# EAGLE design RMP - HV Iso Current Monitor  0.0.1 (EAGLE 9.6.2)

## Sheet 1 of 4
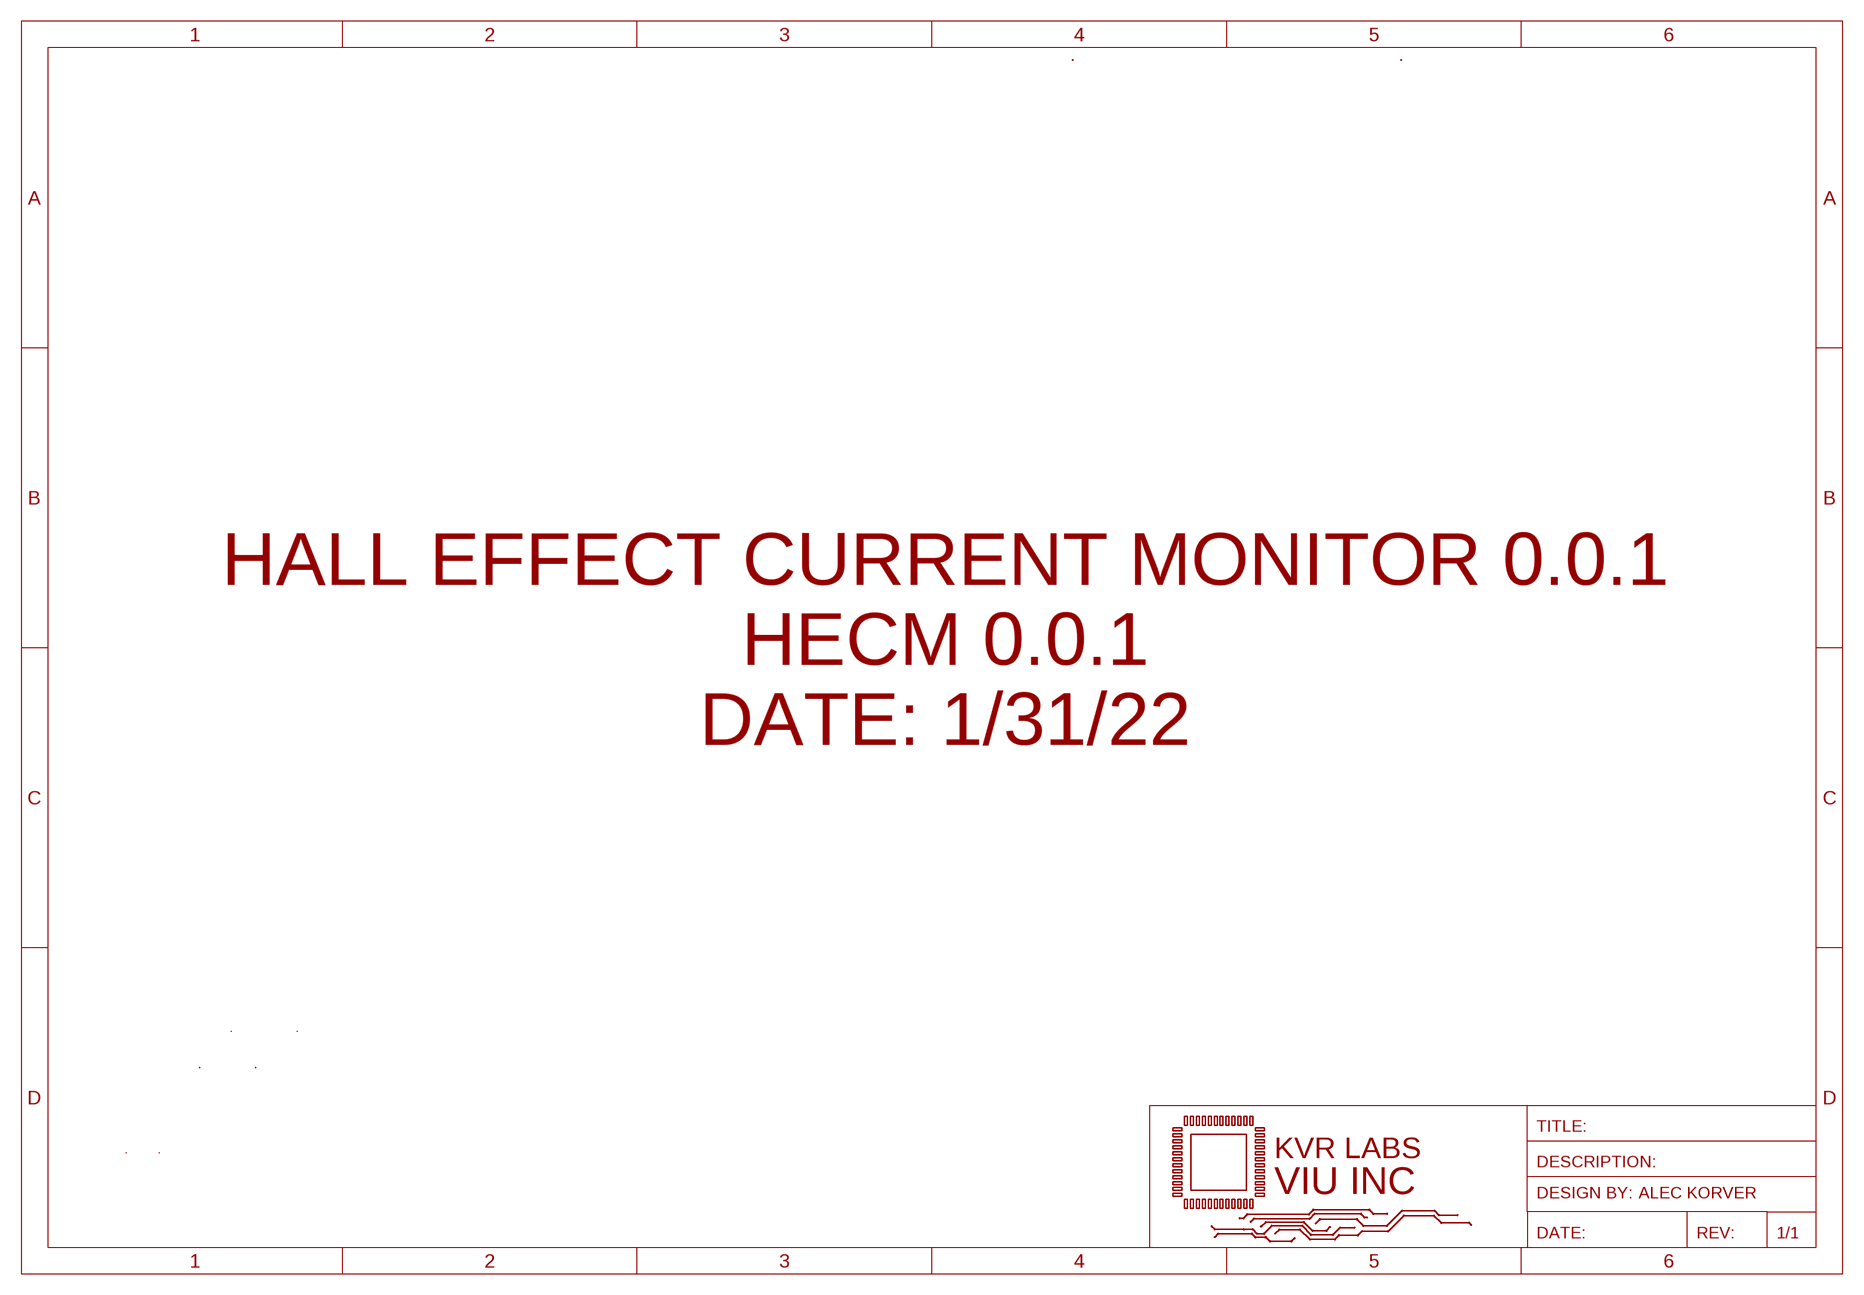
[diagram p0: schematic, sheet 1]

### Notes on the sheet
- HALL EFFECT CURRENT MONITOR 0.0.1
  HECM 0.0.1
  DATE: 1/31/22

## Sheet 2 of 4: HV-Current Monitor
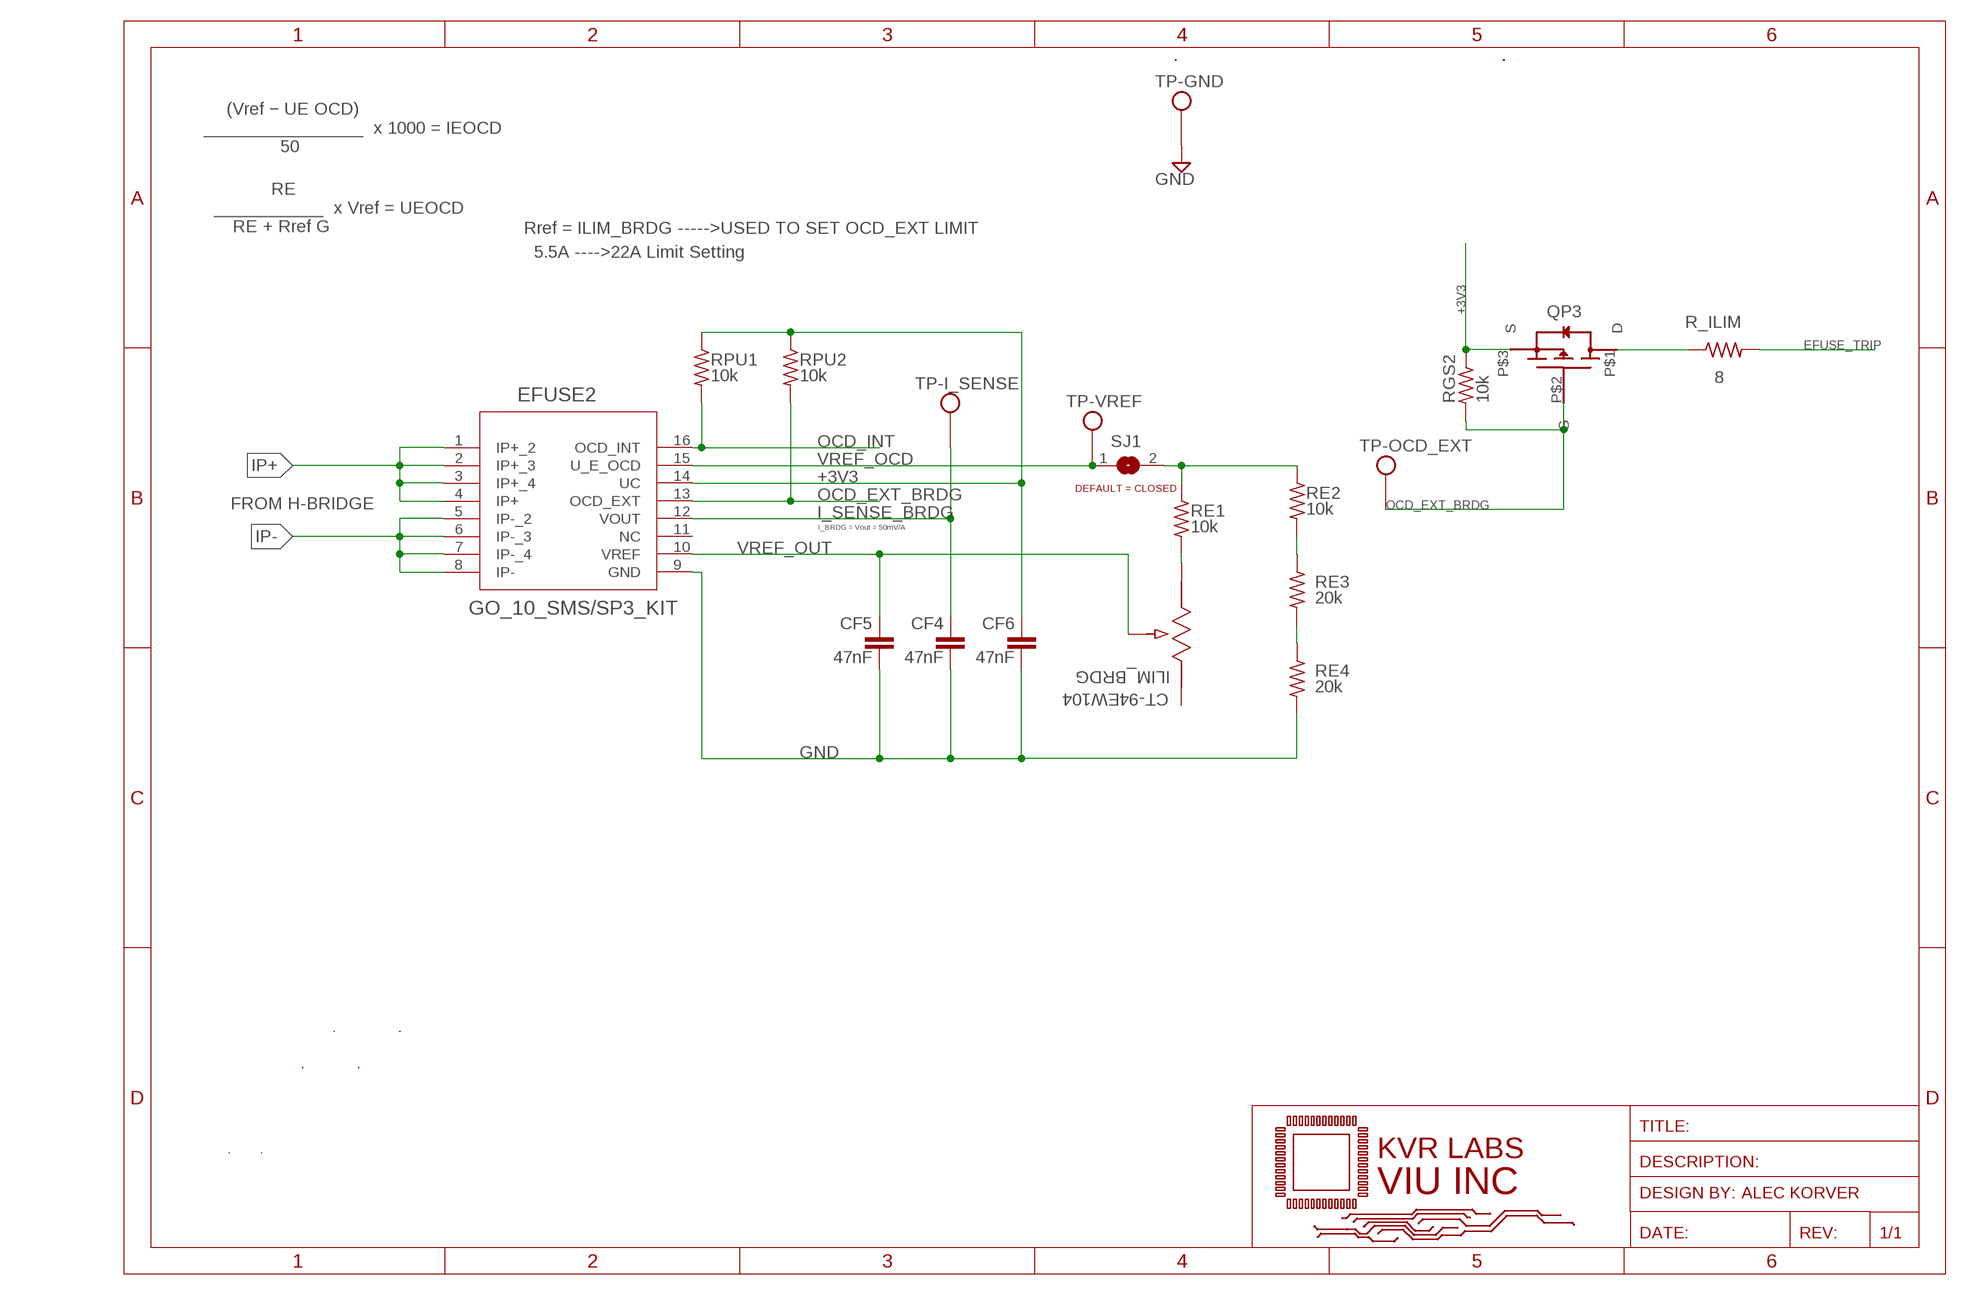
[diagram p1: schematic, sheet 2]

### Parts
CF4  47nF  C-EUC0603  [C0603]
CF5  47nF  C-EUC0603  [C0603]
CF6  47nF  C-EUC0603  [C0603]
EFUSE2  GO_10_SMS/SP3_KIT  [SOIC_GO_10_SM_LEM]
ILIM_BRDG  CT-94EW104  [POT_CT-94EW_NDC]
QP3  PFET-(SOT-23-3)(TO-236-3)(SC-59)  [SOT23,SC-59,TO-236-3]
R_ILIM  8  R-US_R1206  [R1206]
RE1  10k  R-US_R0603  [R0603]
RE2  10k  R-US_R0603  [R0603]
RE3  20k  R-US_R0603  [R0603]
RE4  20k  R-US_R0603  [R0603]
RGS2  10k  R-US_R0603  [R0603]
RPU1  10k  R-US_R0603  [R0603]
RPU2  10k  R-US_R0603  [R0603]
SJ1  SJ  [SJ]
TP-GND  THM_TESTPOINT_5000_SERIES  [THM-TESTPOINT]
TP-I_SENSE  THM_TESTPOINT_5000_SERIES  [THM-TESTPOINT]
TP-OCD_EXT  THM_TESTPOINT_5000_SERIES  [THM-TESTPOINT]
TP-VREF  THM_TESTPOINT_5000_SERIES  [THM-TESTPOINT]

### Nets
+3V3: CF6.1 EFUSE2.14(UC) QP3.P$3(S) RGS2.1 RPU1.1 RPU2.1 ; also sheet 3
EFUSE_TRIP: R_ILIM.2 ; also sheet 4
GND: CF4.2 CF5.2 CF6.2 EFUSE2.9(GND) RE4.2 TP-GND.P1 ; also sheet 3,4
I_SENSE_BRDG: CF4.1 EFUSE2.12(VOUT) TP-I_SENSE.P1 ; also sheet 4
IP+: EFUSE2.1(IP+_2) EFUSE2.2(IP+_3) EFUSE2.3(IP+_4) EFUSE2.4(IP+) ; also sheet 4
IP-: EFUSE2.5(IP-_2) EFUSE2.6(IP-_3) EFUSE2.7(IP-_4) EFUSE2.8(IP-) ; also sheet 4
N$3: RE1.1 RE2.1 SJ1.2
N$14: RE2.2 RE3.1
N$15: RE3.2 RE4.1
N$16: QP3.P$1(D) R_ILIM.1
N$37: ILIM_BRDG.3 RE1.2
OCD_EXT_BRDG: EFUSE2.13(OCD_EXT) QP3.P$2(G) RGS2.2 RPU2.2 TP-OCD_EXT.P1
OCD_INT: EFUSE2.16(OCD_INT) RPU1.2
VREF_OCD: EFUSE2.15(U_E_OCD) SJ1.1 TP-VREF.P1 ; also sheet 4
VREF_OUT: CF5.1 EFUSE2.10(VREF) ILIM_BRDG.2
Unconnected: EFUSE2.11(NC) ILIM_BRDG.1

### Notes on the sheet
- (Vref − UE OCD)
                          ________________  x 1000 = IEOCD
  50
- RE
                        ___________  x Vref = UEOCD
  RE + Rref G
- Rref = ILIM_BRDG ----->USED TO SET OCD_EXT LIMIT
- 5.5A ---->22A Limit Setting
- DEFAULT = CLOSED
- FROM H-BRIDGE
- I_BRDG = Vout = 50mV/A

## Sheet 3 of 4: POWER SUPPLY - DC/DC
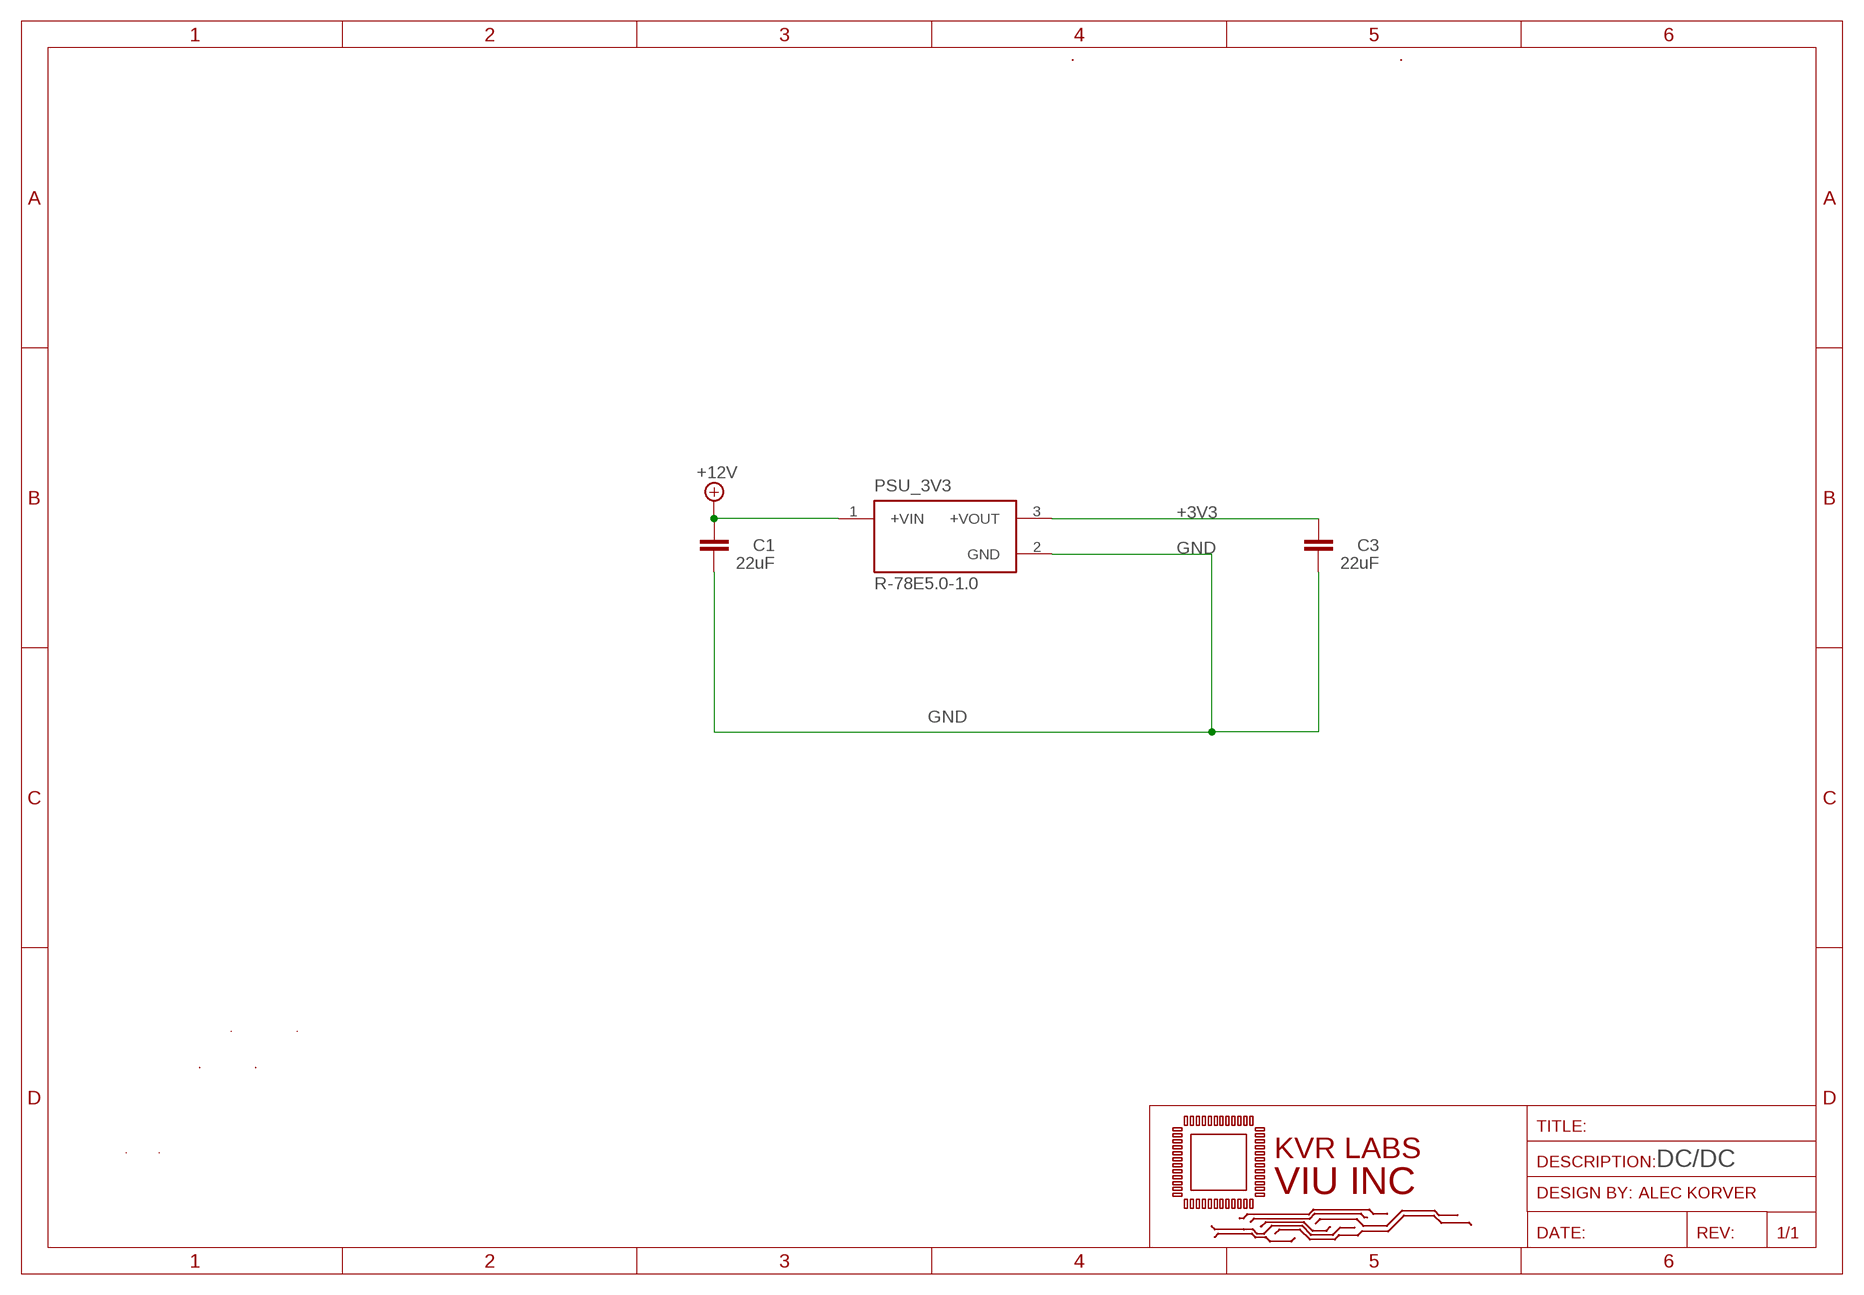
[diagram p2: schematic, sheet 3]

### Parts
C1  22uF  C-EUC1206  [C1206]
C3  22uF  C-EUC1206  [C1206]
PSU_3V3  R-78E5.0-1.0  [CONV_R-78E5.0-1.0]

### Nets
+3V3: C3.2 PSU_3V3.3(+VOUT) ; also sheet 2
+12V: C1.2 PSU_3V3.1(+VIN) ; also sheet 4
GND: C1.1 C3.1 PSU_3V3.2(GND) ; also sheet 2,4

### Notes on the sheet
- DC/DC

## Sheet 4 of 4: CONNECTORS
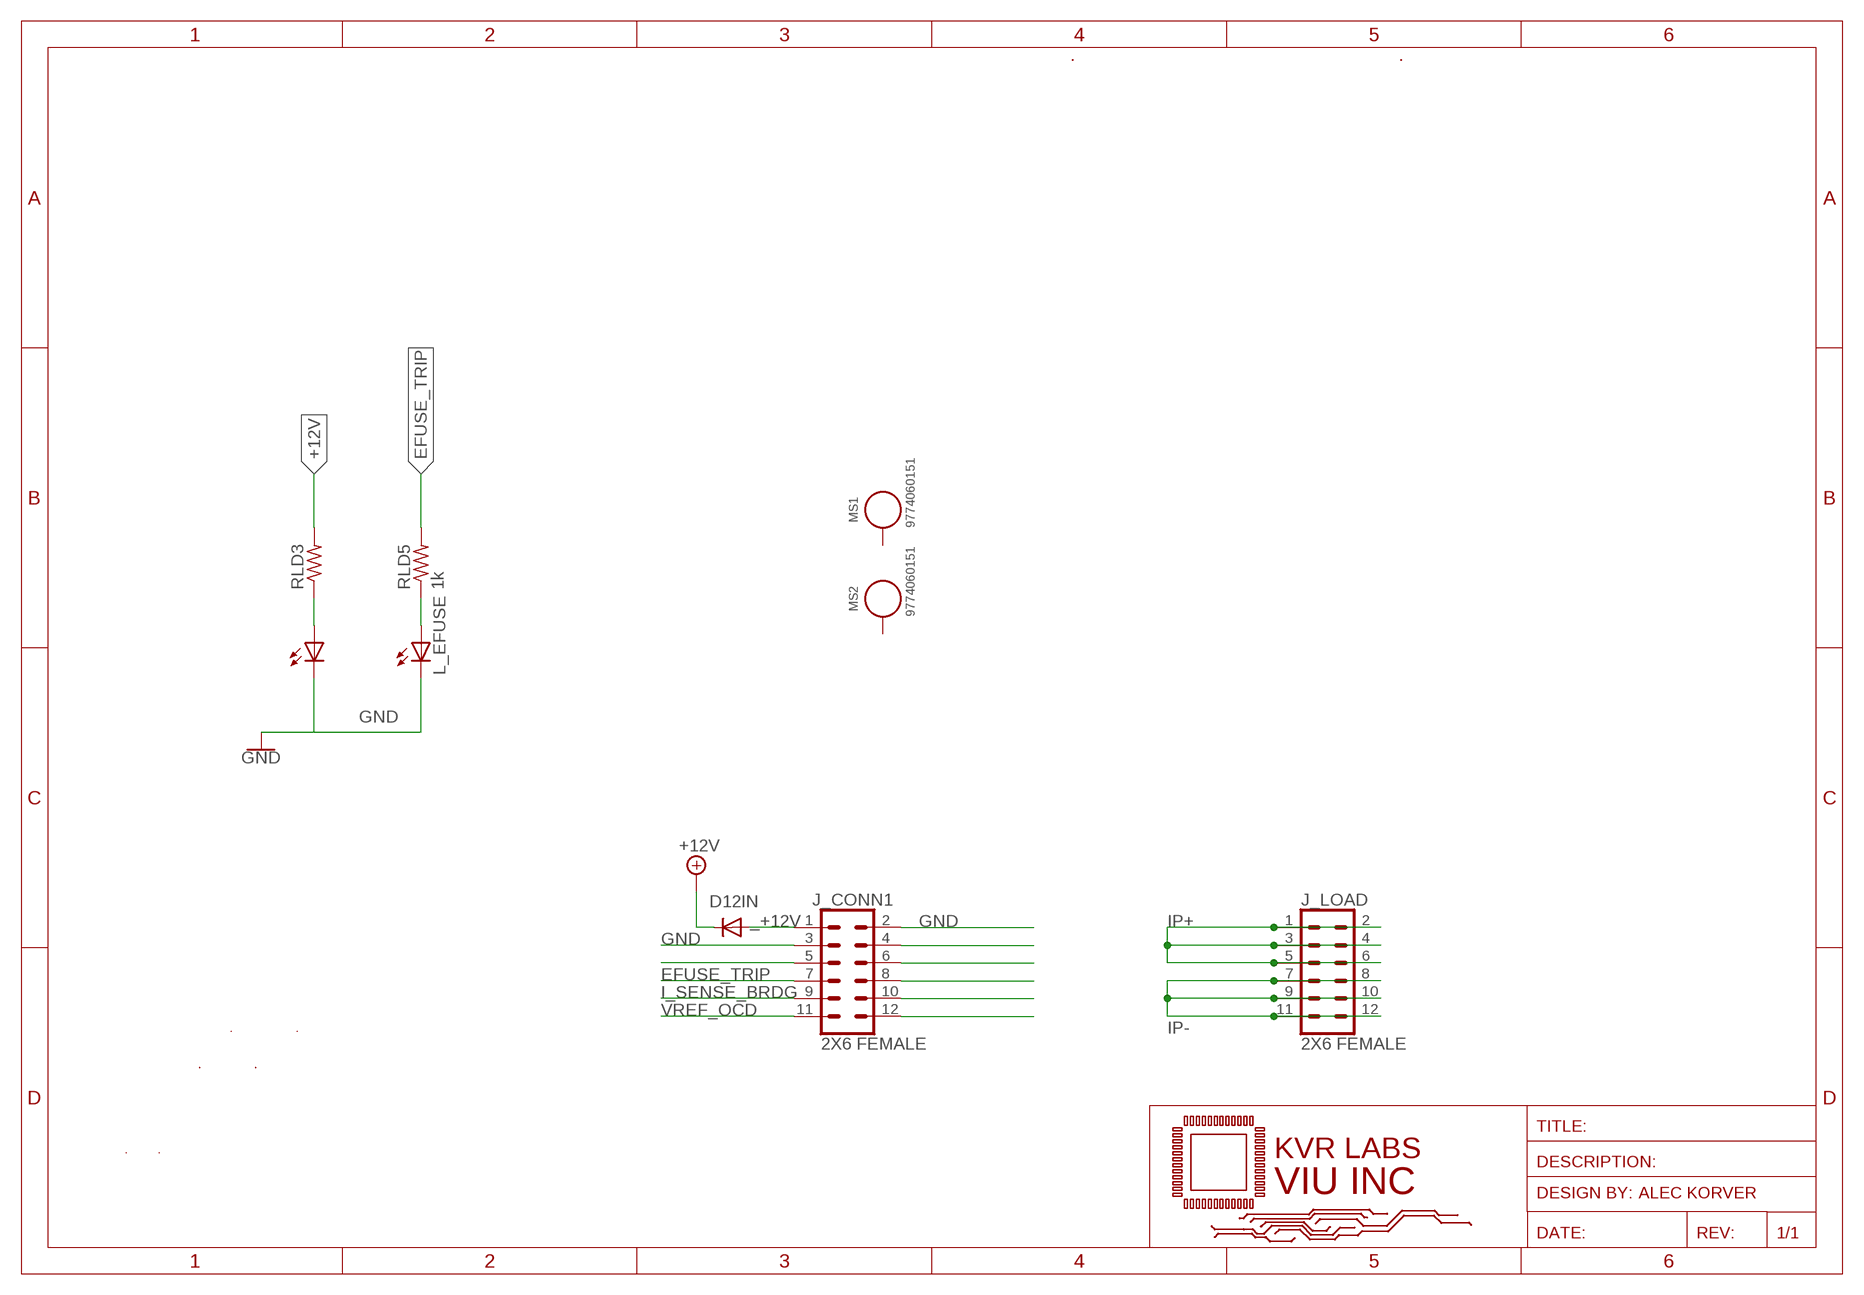
[diagram p3: schematic, sheet 4]

### Parts
D12IN  DIODESMA  [SMADIODE]
J_CONN1  2X6 FEMALE  CONN_06X2PTH_FEMALE  [2X6]
J_LOAD  2X6 FEMALE  CONN_06X2PTH_FEMALE  [2X6]
L_12V  LEDCHIPLED_1206  [CHIPLED_1206]
L_EFUSE  LEDCHIPLED_1206  [CHIPLED_1206]
MS1  9774060151  WA-SMSI_9774XXX151_9774060151  [WA-SMSI_9774060151]
MS2  9774060151  WA-SMSI_9774XXX151_9774060151  [WA-SMSI_9774060151]
RLD3  1k  R-US_R1206  [R1206]
RLD5  1k  R-US_R1206  [R1206]

### Nets
+12V: D12IN.C RLD3.2 ; also sheet 3
_+12V: D12IN.A J_CONN1.1
EFUSE_TRIP: J_CONN1.7 RLD5.2 ; also sheet 2
GND: J_CONN1.2 J_CONN1.3 L_12V.C ; also sheet 2,3
GND2: L_EFUSE.C
I_SENSE_BRDG: J_CONN1.9 ; also sheet 2
IP+: J_LOAD.1 J_LOAD.2 J_LOAD.3 J_LOAD.4 J_LOAD.5 J_LOAD.6 ; also sheet 2
IP-: J_LOAD.7 J_LOAD.8 J_LOAD.9 J_LOAD.10 J_LOAD.11 J_LOAD.12 ; also sheet 2
N$1: J_CONN1.10
N$2: J_CONN1.12
N$4: J_CONN1.4
N$5: J_CONN1.6
N$6: J_CONN1.8
N$9: J_CONN1.5
N$20: L_12V.A RLD3.1
N$23: L_EFUSE.A RLD5.1
VREF_OCD: J_CONN1.11 ; also sheet 2
Unconnected: MS1.1 MS2.1

## Library data of the parts
C1 C3 = rcl:C-EU: CAPACITOR, European symbol; LCSC_PART: C77091; SPICEPREFIX: C
CF4-CF6 = rcl:C-EU: CAPACITOR, European symbol; LCSC_PART: C76712; SPICEPREFIX: C
D12IN = adafruit:DIODE: Diode SMADIODE - SMA Surface Mount Package 20V 1A Schottky Diode Digikey: 641-1014-6-ND DO-1N4148 - Through Hole Small Current Diode SOD-123 20V 1 A (.5mV Vf) Schottky Diode - Digikey: MBRX120TPMSCT-ND SOD-323 10V 570mA (.38mV Vf, 3ns) Schottky Diode - Digikey: ZLLS410CT-ND SOD-523 30V 30mA Schottky Diode (RB751S-40TE61) - Digikey: RB751S-40TE61CT-ND SOT23-R/W - SOT23 Package (R = Solder Paste/Reflow Ovens, W = Hand-Soldering) BAT54Film 40V 300mA - Digikey: 497-7162-1-ND; I_AVG: 1A; LCSC_PART: C110531; VF: 1.3V; VR: 400V
EFUSE2 = KVRLABS-Amplifiers:GO_10_SMS/SP3_KIT; COPYRIGHT: Copyright (C) 2021 Ultra Librarian. All rights reserved.; LCSC_PART: DNP; MANUFACTURER_PART_NUMBER: GO 10 SMS/SP3 KIT; MFR_NAME: LEM
ILIM_BRDG = KVRLABS-Potentiometers:CT-94EW104; COPYRIGHT: Copyright (C) 2021 Ultra Librarian. All rights reserved.; DIGI-KEY_PART_NUMBER_1: CT94EW104-ND; LCSC_PART: DNP; MANUFACTURER_PART_NUMBER: CT-94EW104; MFR_NAME: Nidec Copal Electronics
J_CONN1 J_LOAD = SparkFun-Connectors:CONN_06X2: Multi connection point. Often used as Generic Header-pin footprint for 0.1 inch spaced/style header connections On any of the 0.1 inch spaced packages, you can populate with these: Break Away Headers - Straight <https://www.sparkfun.com/products/116> (PRT-00116) Break Away Male Headers - Right Angle <https://www.sparkfun.com/products/553> (PRT-00553) Female Headers <https://www.sparkfun.com/products/115> (PRT-00115) Break Away Headers - Machine Pin <https://www.sparkfun.com/products/117> (PRT-00117) Break Away Female Headers - Swiss Machine Pin <https://www.sparkfun.com/products/743> (PRT-00743); LCSC_PART: DNP; MODEL: TSW-106-05-G-D; PROD_ID: CONN-12423
L_12V L_EFUSE = adafruit:LED: LED OSRAM: - CHIPLED LG R971, LG N971, LY N971, LG Q971, LY Q971, LO R971, LY R971 LH N974, LH R974 LS Q976, LO Q976, LY Q976 LO Q996 - Hyper CHIPLED LW Q18S LB Q993, LB Q99A, LB R99A - SideLED LS A670, LO A670, LY A670, LG A670, LP A670 LB A673, LV A673, LT A673, LW A673 LH A674 LY A675 LS A676, LA A676, LO A676, LY A676, LW A676 LS A679, LY A679, LG A679 - Hyper Micro SIDELED® LS Y876, LA Y876, LO Y876, LY Y876 LT Y87S - SmartLED LW L88C, LW L88S LB L89C, LB L89S, LG L890 LS L89K, LO L89K, LY L89K LS L896, LA L896, LO L896, LY L896 - TOPLED LS T670, LO T670, LY T670, LG T670, LP T670 LSG T670, LSP T670, LSY T670, LOP T670, LYG T670 LG T671, LOG T671, LSG T671 LB T673, LV T673, LT T673, LW T673 LH T674 LS T676, LA T676, LO T676, LY T676, LB T676, LH T676, LSB T676, LW T676 LB T67C, LV T67C, LT T67C, LS T67K, LO T67K, LY T67K, LW E67C LS E67B, LA E67B, LO E67B, LY E67B, LB E67C, LV E67C, LT E67C LW T67C LS T679, LY T679, LG T679 LS T770, LO T770, LY T770, LG T770, LP T770 LB T773, LV T773, LT T773, LW T773 LH T774 LS E675, LA E675, LY E675, LS T675 LS T776, LA T776, LO T776, LY T776, LB T776 LHGB T686 LT T68C, LB T68C - Hyper Mini TOPLED® LB M676 - Mini TOPLED Santana® LG M470 LS M47K, LO M47K, LY M47K Source: http://www.osram.convergy.de/; LCSC_PART: C434439
MS1 MS2 = Eagle_WA-SMSI (rev20d) (1):WA-SMSI_9774XXX151: WA-SMSI SMT Steel Spacer, M2.5 Thread Internal PROPERTIES Material Steel Surface Tin GENERAL INFORMATION Operating Temperature -55 up to +150 °C PACKAGING PROPERTIES Packaging Bag;​ Tape and Reel;​ Bulk Packaging Unit 450 <https://katalog.we-online.de/media/images/v2/o92910v209%20Family_WA-SMSI_M2-M2.5.jpg> Details see: https://katalog.we-online.de/en/em/SMSI_SMT_STEEL_SPACER_M2_5_THREAD_INTERNAL Updated by Ella Wu 2020-05-18 2020(C) Wurth Elektronik; DATASHEET-URL: https://www.we-online.de/katalog/datasheet/9774060151.pdf; INNER-DIAMETER: 3.5mm; INNER-THREAD-LENGTH: -; OUTER-DIAMETER: 5.1mm; PART-NUMBER: 9774060151; PIN-LENGTH: 6mm; THREAD: M2.5
PSU_3V3 = R-78E5.0-1.0:R-78E5.0-1.0: 1.0 Amp SIP3 Single Output; DESCRIPTION: 1A DC/DC-Converter 'INNOLINE' SIP3 reg; LCSC_PART: DNP; MF: Recom Power; MP: R-78E5.0-1.0; PACKAGE: SIP-3 Recom Power; PURCHASE-URL: https://pricing.snapeda.com/search/part/R-78E5.0-1.0/?ref=eda
QP3 = KVRLABS-Nfet:Pfet:PFET-(SOT-23-3)(TO-236-3)(SC-59); LCSC_PART: C489594; MODEL: MEM2307M3G
R_ILIM = rcl:R-US_: RESISTOR, American symbol; LCSC_PART: C114478; SPICEPREFIX: R
RE1 RE2 RGS2 RPU1 RPU2 = rcl:R-US_: RESISTOR, American symbol; LCSC_PART: C116677; SPICEPREFIX: R
RE3 RE4 = rcl:R-US_: RESISTOR, American symbol; LCSC_PART: C118368; SPICEPREFIX: R
RLD3 RLD5 = rcl:R-US_: RESISTOR, American symbol; LCSC_PART: C115421; SPICEPREFIX: R
SJ1 = jumper:SJ: SMD solder JUMPER
TP-GND TP-I_SENSE TP-OCD_EXT TP-VREF = PSFBC:THM_TESTPOINT_5000_SERIES; LCSC_PART: DNP

## Net classes
0 default: width 0.089 mm, drill 0.2 mm, clearance 0.089 mm

## Board
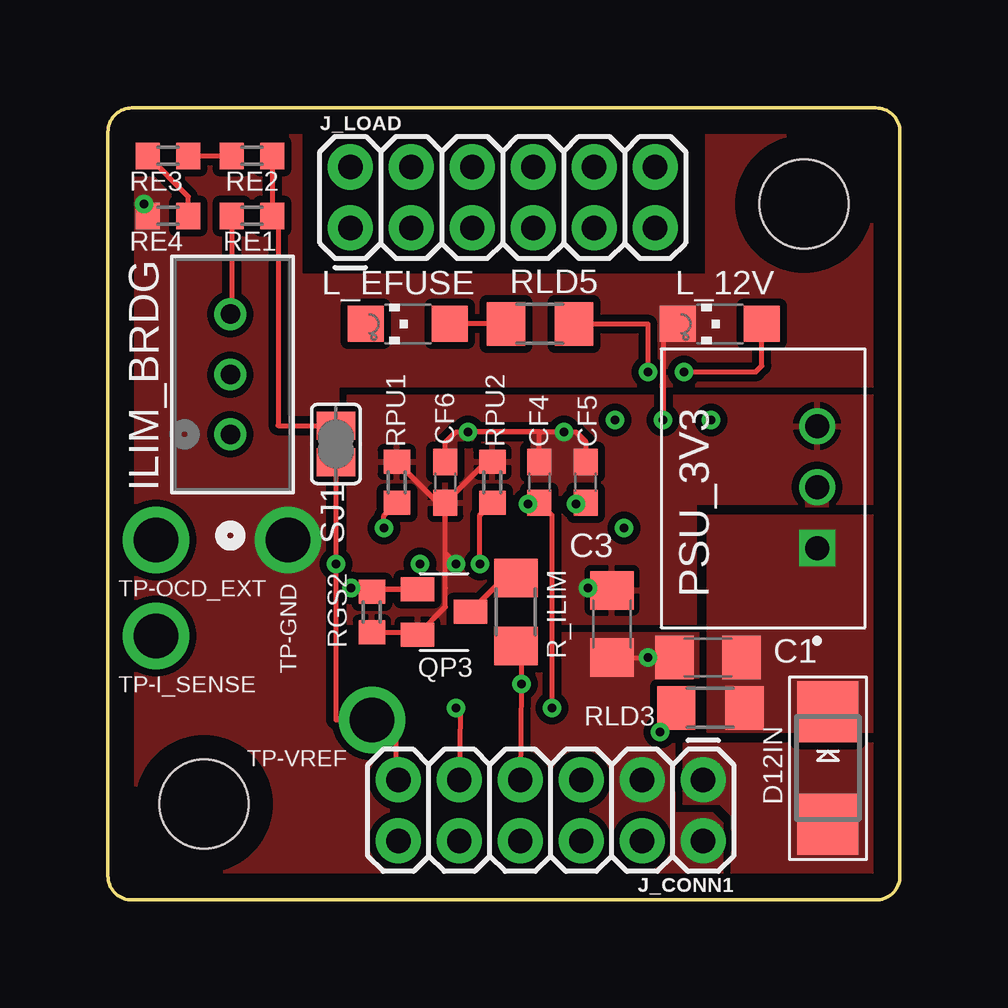
[diagram p4: board, top side]
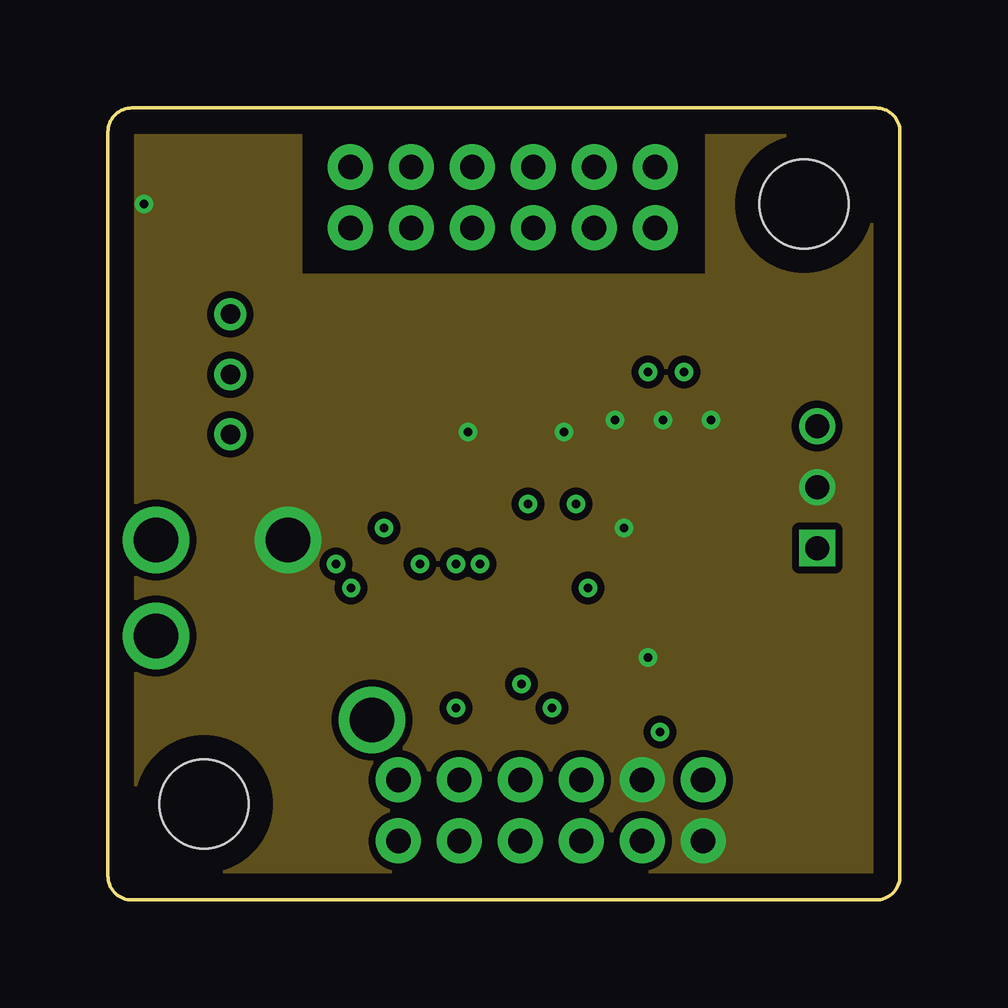
[diagram p5: board, inner layer Route2]
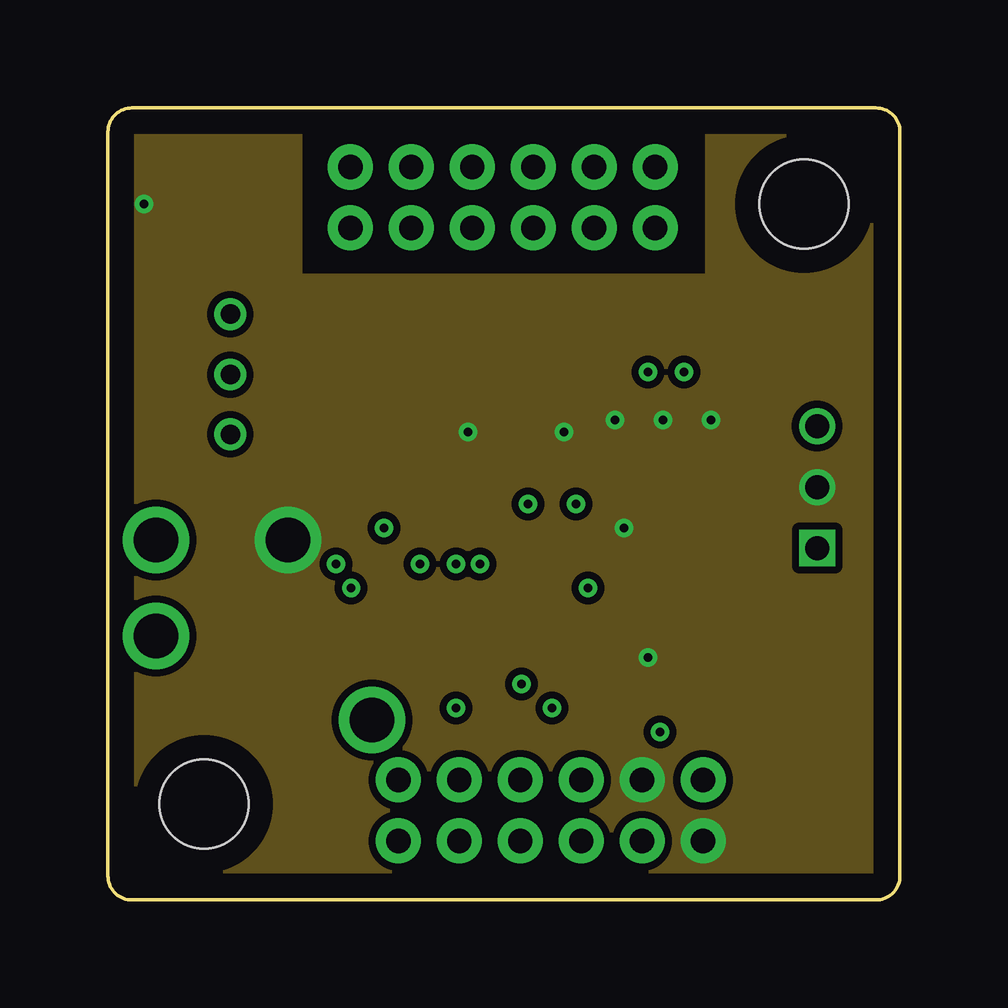
[diagram p6: board, inner layer Route15]
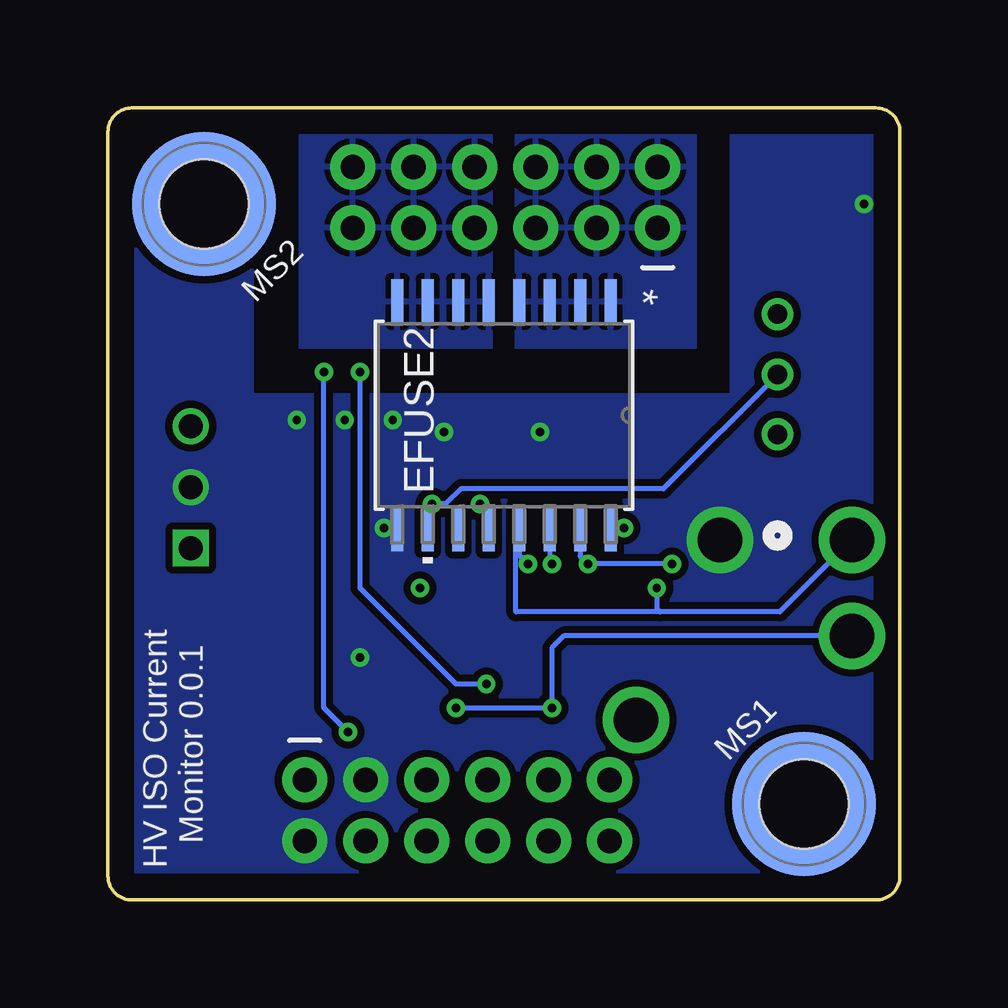
[diagram p7: board, bottom side, seen from below]

Size 33 x 33 mm. Coordinates in mm from the lower left corner, seen from the top.
Outline: 0,1 0,32 arc-90 1,33 32,33 arc-90 33,32 33,1 arc-90 32,0 1,0 arc-90 0,1
Copper layers (1*2*15*16): Top 0.035mm / dielectric 1.5mm / Route2 0.035mm / dielectric 0.15mm / Route15 0.035mm / dielectric 0.2mm / Bottom 0.035mm
Design rules "default *": minimum track width 6mil, minimum drill 0.35mm, track to track 6mil, track to pad 6mil, pad to pad 6mil, via to via 6mil, smd to smd 6mil, copper to edge 40mil, drill to drill 6mil, minimum pad ring 10mil, minimum via ring 8mil, stop-mask expansion 4mil, vias tented up to drill 0mil, thermal gap 10mil
vRestrict: 1 lines

### Footprints (pad centres in the part's own frame; a part is rotated, then mirrored left to right if it is on the bottom)
C1206 = smd 1.6 x 1.8: 1 -1.4,0; 2 1.4,0
C0603 = smd 1.1 x 1: 1 -0.85,0; 2 0.85,0
SMADIODE = smd 2.54 x 2.54: A 2.349,0; C -2.349,0
SOIC_GO_10_SM_LEM = smd 1.874 x 0.507: 1 -4.734,4.445; 2 -4.734,3.175; 3 -4.734,1.905; 4 -4.734,0.635; 5 -4.734,-0.635; 6 -4.734,-1.905; 7 -4.734,-3.175; 8 -4.734,-4.445; 9 4.734,-4.445; 10 4.734,-3.175; 11 4.734,-1.905; 12 4.734,-0.635; 13 4.734,0.635; 14 4.734,1.905; 15 4.734,3.175; 16 4.734,4.445
POT_CT-94EW_NDC = drill 0.813 pad 1.321: 1 0,0; 2 2.489,0; 3 5.004,0
2X6 = drill 1.016 pad 1.88: 1 0,0; 2 0,2.54; 3 2.54,0; 4 2.54,2.54; 5 5.08,0; 6 5.08,2.54; 7 7.62,0; 8 7.62,2.54; 9 10.16,0; 10 10.16,2.54; 11 12.7,0; 12 12.7,2.54
CHIPLED_1206 = smd 1.5 x 1.5: A 0,-1.75; C 0,1.75
WA-SMSI_9774060151 = smd 6 x 6: 1 0,0 | hole 3.7: 0,0
CONV_R-78E5.0-1.0 = drill 1 square: 1 -2.54,-2.25 | drill 1: 2 0,-2.25; 3 2.54,-2.25
SOT23,SC-59,TO-236-3 = smd 1 x 1.4: P$1 0,1.1; P$2 -0.95,-1.1; P$3 0.95,-1.1
R1206 = smd 1.6 x 1.803: 1 -1.422,0; 2 1.422,0
R0603 = smd 1 x 1.1: 1 -0.85,0; 2 0.85,0
SJ = smd 1.168 x 1.6: 1 -0.762,0; 2 0.762,0
THM-TESTPOINT = drill 1.84: P1 0,0

### Placement (x,y rotation side)
C1  25,10.1 0 top
C3  21,11.5 90 top
CF4  17.98,17.4 90 top
CF5  19.9,17.4 90 top
CF6  14.06,17.4 90 top
D12IN  30,5.5 270 top
EFUSE2  16.5,20.2 270 bottom
ILIM_BRDG  5.1,19.4 90 top
J_CONN1  24.8,5 180 top
J_LOAD  10.1,28 0 top
L_12V  25.5,24 90 top
L_EFUSE  12.5,24 90 top
MS1  4,4 0 bottom
MS2  29,29 0 bottom
PSU_3V3  27.3,17.2 90 top
QP3  14,12 270 top
R_ILIM  17,12 270 top
RE1  6,28.5 180 top
RE2  6,31 180 top
RE3  2.5,31 180 top
RE4  2.5,28.5 180 top
RGS2  11,12 90 top
RLD3  25.1,8 0 top
RLD5  18,24 0 top
RPU1  12.04,17.4 270 top
RPU2  16.02,17.4 270 top
SJ1  9.5,19 90 top
TP-GND  7.5,15 0 top
TP-I_SENSE  2,11 0 top
TP-OCD_EXT  2,15 0 top
TP-VREF  11,7.5 180 top

### Tracks (layer width: path | path; a pad name or v marks a point on that pad's centre or on a via)
+3V3  (via drill 0.35)
  Top 0.2: QP3.P$3 14.06,12.21 14.06,13 14.06,14.44
  Top 0.203: RPU1.1 13.74,16.55 CF6.1 | CF6.1 15.76,18.25 RPU2.1 | v14.5,14 14.06,14.44 CF6.1 | RGS2.1 12.8,11.15 QP3.P$3 | C3.2 20.1,12.9 v20,13
  Bottom 0.203: EFUSE2.14 14.6,14.1 v14.5,14
  pour Top (isolate 0.3): 10,11.5 24.5,11.5 24.5,16.5 34,16.5 34,21 10,21
+12V
  pour Top (isolate 0.3, no thermals): 27.5,7 34,7 34,16 25,16 25,7
_+12V
  pour Top (isolate 0.3, no thermals): 24,4 25.5,4 26,3.5 26,-1 34.5,-1 34.5,6.5 24,6.5
EFUSE_TRIP  (via drill 0.35)
  Top 0.2: R_ILIM.2 17.23,10.35 v17.23,9 J_CONN1.7 | RLD5.2 22.5,24 v22.5,22
  Bottom 0.2: v22.5,22 22.5,13 18.5,9 v17.23,9
GND  (via drill 0.35)
  Top 0.2: L_12V.C 23.13,23.38 v23.13,20
  Top 0.203: CF6.2 14.06,19.06 14.5,19.5 v15,19.5 18,19.5 | 18,19.5 v19,19.5 19.5,19.5 19.9,19.1 CF5.2 | CF4.2 17.98,19.48 18,19.5 | RE4.2 1.65,28.85 v1.5,29 | C3.1 v22.5,10.1 C1.1
  Bottom 0.203: EFUSE2.9 21.47,15.47 v21.5,15.5
  other vias: 25.13,20 21.13,20
  pour Route2 (isolate 0.3, no thermals): -2,0 -2,35 8,35 8,26 25,26 25,35 35,35 35,-2 -2,-2
  pour Route15 (isolate 0.3, no thermals): -2,0 -2,35 8,35 8,26 25,26 25,35 35,35 35,-2 -2,-2
  pour Top (isolate 0.3, rank 5, no thermals): -2,0 -2,35 8,35 8,26 25,26 25,35 35,35 35,-2 -2,-2
  pour Bottom (isolate 0.3, no thermals): 7,35 7,21 27,21 27,35 35,35 35,-2 -2,-2 -2,35
I_SENSE_BRDG  (via drill 0.35)
  Top 0.2: CF4.1 18.5,16.03 v18.5,8 | v14.5,8 14.69,7.81 J_CONN1.9
  Top 0.203: v17.5,16.5 17.55,16.55 CF4.1
  Bottom 0.2: v18.5,8 v14.5,8 14.5,10.5 14,11 TP-I_SENSE.P1
  Bottom 0.203: EFUSE2.12 17.14,16.14 v17.5,16.5
IP+
  pour Bottom (isolate 0.3): 16,33.5 8.5,33.5 8.5,23 16,23
IP-
  pour Bottom (isolate 0.3): 17,23 17,33.5 25,33.5 25,23
N$3
  Top 0.203: RE2.1 RE1.1 7.09,28.26 7.09,19.76 SJ1.2
N$14
  Top 0.203: RE3.1 RE2.2
N$15
  Top 0.203: RE4.1 3.35,29.3 RE3.2
N$16
  Top 0.203: QP3.P$1 16.52,13.42 R_ILIM.1
N$20  (via drill 0.35)
  Top 0.2: RLD3.1 23,7.32 v23,7 | v24,22 27,22 27.25,22.25 L_12V.A
  Bottom 0.2: v23,7 24,8 v24,22
N$23
  Top 0.2: RLD5.1 L_EFUSE.A
N$37
  Top 0.203: RE1.2 5.15,24.45 ILIM_BRDG.3
OCD_EXT_BRDG  (via drill 0.35)
  Top 0.2: QP3.P$2 10.18,12.95 v10.13,13
  Top 0.203: v15.5,14 15.5,16.03 RPU2.2 | RGS2.2 11.1,12.95 QP3.P$2
  Bottom 0.2: TP-OCD_EXT.P1 5,12 10,12 | 15.87,15 16,14.87 16,12 10,12 | v10.13,13 10.13,12.13 10,12
  Bottom 0.203: EFUSE2.13 15.87,15 15.87,14.37 v15.5,14
OCD_INT  (via drill 0.35)
  Top 0.203: v11.5,15.5 11.5,16.01 RPU1.2
  Bottom 0.203: EFUSE2.16 11.53,15.47 v11.5,15.5
VREF_OCD  (via drill 0.35)
  Top 0.2: J_CONN1.11 12,5 12,7.5 TP-VREF.P1
  Top 0.203: SJ1.1 v9.5,14 9.5,7.5 TP-VREF.P1
  Bottom 0.203: EFUSE2.15 13.32,14.32 v13,14 v9.5,14
VREF_OUT  (via drill 0.35)
  Top 0.2: CF5.1 19.85,16.5 v19.5,16.5
  Bottom 0.203: EFUSE2.10 19.68,16.32 v19.5,16.5 18.92,16.5 18.29,17.13 9.86,17.13 ILIM_BRDG.2

### Text on the board
bNames: HV ISO Current / Monitor 0.0.1